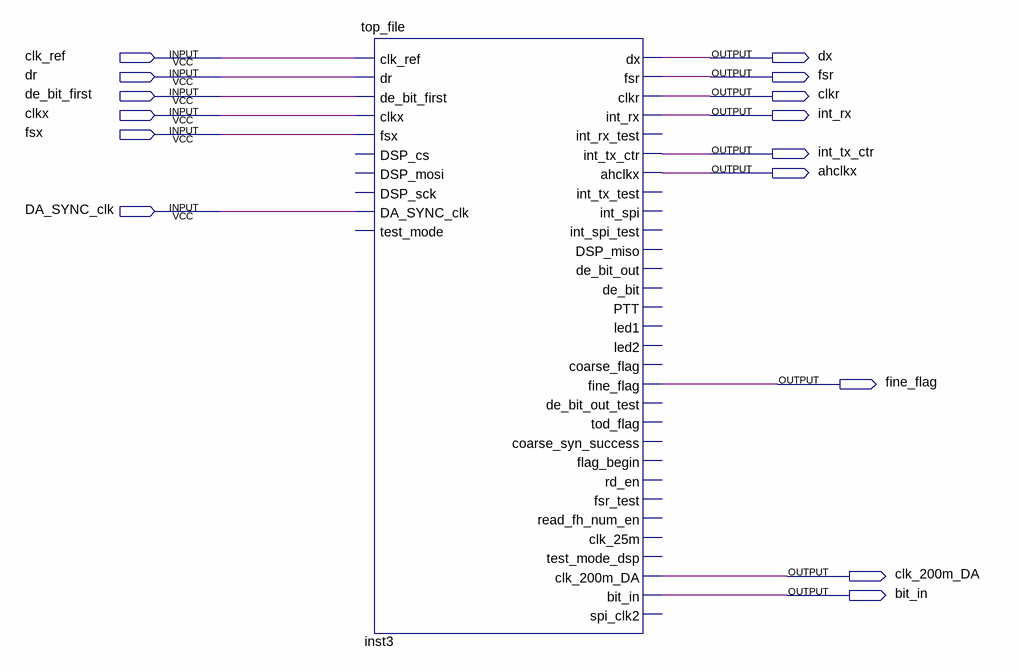
[diagram p0: schematic sheet]
// Quartus schematic sdr_dsp_fpga_test.bdf as structural Verilog: 1 symbols, 15 pins
module sdr_dsp_fpga_test (
  input  clk_ref,
  input  dr,
  input  de_bit_first,
  input  clkx,
  input  fsx,
  input  DA_SYNC_clk,
  output dx,
  output fsr,
  output clkr,
  output int_rx,
  output int_tx_ctr,
  output ahclkx,
  output fine_flag,
  output clk_200m_DA,
  output bit_in
);

  top_file inst3 (
    .clk_ref(clk_ref), .dr(dr), .de_bit_first(de_bit_first), .clkx(clkx), .fsx(fsx),
    .DA_SYNC_clk(DA_SYNC_clk), .dx(dx), .fsr(fsr), .clkr(clkr), .int_rx(int_rx), .int_tx_ctr(int_tx_ctr),
    .ahclkx(ahclkx), .fine_flag(fine_flag), .clk_200m_DA(clk_200m_DA), .bit_in(bit_in));  // open: DSP_cs, DSP_mosi, DSP_sck, test_mode, int_rx_test, int_tx_test, int_spi, int_spi_test, DSP_miso, de_bit_out, de_bit, PTT, led1, led2, coarse_flag, de_bit_out_test, tod_flag, coarse_syn_success, flag_begin, rd_en, fsr_test, read_fh_num_en, clk_25m, test_mode_dsp, spi_clk2
endmodule
